# Altium schematic sheet 3_3.SchDoc
size 209 x 297 mm; Scale: 1:1; Разраб.: Иванов; Обозначение документа: АБВГ.123456.001 Э3; Пров.: Петров; Утв.: Сидоров; Наименование организации: ОАО "Концерн "МПО-Гидроприбор"; Перв. применение: АБВГ.123456.000; Наименование изделия 1: Плата; Наименование изделия 2: Схема электрическая; Наименование изделия 3: принципиальная; Нач. отд.: Нач. отд.; Фамилия нач. отд.: Сидоров
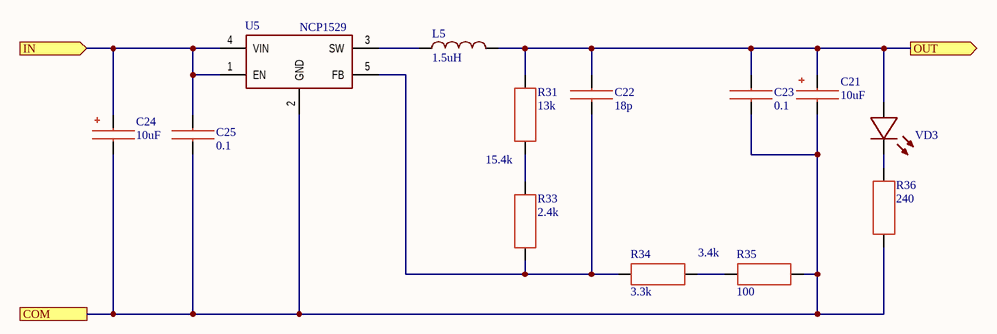
[diagram p0: 3_3.SchDoc]

## Parts
C21  10uF  [Tantal Type C]
C22  18p  [CC0805_3D]
C23  0.1  [CC0805_3D]
C24  10uF  [Tantal Type C]
C25  0.1  [CC0805_3D]
L5  1.5uH  [SDR0805]
R31  13k  [RC0805_3D]
R33  2.4k  [RC0805_3D]
R34  3.3k  [RC0805_3D]
R35  100  [RC0805_3D]
R36  240  [RC0805_3D]
U5  NCP1529  [TSOP5]
VD3  Value  [2030]  (value not drawn)

## Ports
COM, IN (in), OUT (out)

## Nets
COM: C21.1 C23.1 C24.1 C25.1 R35.2 R36.1 U5.2(GND) ; port COM
IN: C24.2 C25.2 U5.1(EN) U5.4(VIN) ; port IN
OUT: C21.2 C22.2 C23.2 L5.2 R31.2 VD3.2 ; port OUT
NetC22_1: C22.1 R33.1 R34.1 U5.5(FB)
NetL5_1: L5.1 U5.3(SW)
NetR31_1: R31.1 R33.2
NetR34_2: R34.2 R35.1
NetR36_2: R36.2 VD3.1

## Notes on the sheet
- 15.4k
- 3.4k
- Перв. примен.
- Справ. №
- Подп. и дата
- Инв. № дубл.
- Взам. инв. №
- Инв. № подл.
- Изм.
- Лист
- № докум.
- Подп.
- Дата
- Копировал

## Library data of the parts
C21 C24 = Tantal C 10uF: 16 V; Value: 10uF; Voltage: 16 V
C22 C23 C25 = CC0805 X uF
  C22: Value: 18p
  C23 C25: Value: 0.1
L5 = SDR0805: value: 2.5uH; value: 3.3uH; value: 3.9uH; value: 4.7uH; value: 5.6uH; value: 6.8uH; value: 7.5uH; value: 8.2uH; value: 10uH; value: 12uH; value: 15uH; value: 18uH; value: 22uH; value: 27uH; value: 33uH; value: 39uH; value: 47uH; value: 56uH; value: 68uH; value: 82uH; value: 100uH; value: 120uH; value: 150uH; value: 180uH; value: 220uH; value: 270uH; value: 330uH; value: 390uH; value: 470uH; value: 560uH; value: 680uH; value: 820uH; value: 1000uH; value: 1200uH; value: 1500uH; value: 1800uH; value: 2200uH; value: 2700uH; value: 3300uH; value: 3900uH; value: 4700uH; value: 1.5uH
R31 R33-R36 = RC0805 X Ohm
  R31: Value: 13k
  R33: Value: 2.4k
  R34: Value: 3.3k
  R35: Value: 100
  R36: Value: 240
VD3 = KA-3021SGCT